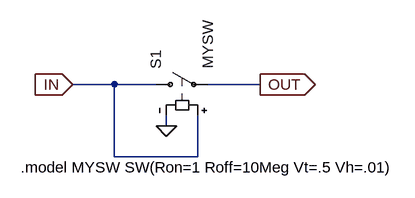
[diagram p0: schematic Config.asc]
Config.asc, the LTspice schematic file:
Version 4
SHEET 1 880 680
WIRE 208 192 144 192
WIRE 272 192 208 192
WIRE 432 192 352 192
WIRE 288 256 288 240
WIRE 208 304 208 192
WIRE 336 304 336 240
WIRE 336 304 208 304
FLAG 432 192 OUT
IOPIN 432 192 Out
FLAG 144 192 IN
IOPIN 144 192 In
FLAG 288 256 0
SYMBOL sw 256 192 R270
SYMATTR InstName S1
SYMATTR Value MYSW
TEXT 64 320 Left 2 !.model MYSW SW(Ron=1 Roff=10Meg Vt=.5 Vh=.01)

The netlist it stands for:
* Config.asc
S1 IN OUT IN 0 MYSW
.model MYSW SW(Ron=1 Roff=10Meg Vt=.5 Vh=.01)
.backanno
.end